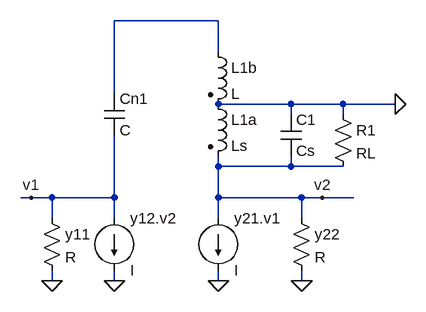
[diagram p0: schematic circuito_AC.asc]
circuito_AC.asc, the LTspice schematic file:
Version 4
SHEET 1 880 680
WIRE 16 -96 -144 -96
WIRE 16 -48 16 -96
WIRE -144 16 -144 -96
WIRE 128 32 16 32
WIRE 208 32 128 32
WIRE 288 32 208 32
WIRE 128 48 128 32
WIRE 208 48 208 32
WIRE 16 128 16 112
WIRE 128 128 128 112
WIRE 128 128 16 128
WIRE 208 128 128 128
WIRE -272 176 -288 176
WIRE -240 176 -272 176
WIRE -144 176 -144 80
WIRE -144 176 -240 176
WIRE 16 176 16 128
WIRE 144 176 16 176
WIRE 176 176 144 176
WIRE 224 176 176 176
WIRE -240 208 -240 176
WIRE -144 208 -144 176
WIRE 16 208 16 176
WIRE 144 208 144 176
WIRE -240 304 -240 288
WIRE -144 304 -144 288
WIRE 16 304 16 288
WIRE 144 304 144 288
FLAG 288 32 0
FLAG 16 304 0
FLAG -144 304 0
FLAG -240 304 0
FLAG 144 304 0
FLAG 176 176 v2
FLAG -272 176 v1
SYMBOL ind2 0 16 R0
SYMATTR InstName L1a
SYMATTR Value Ls
SYMATTR Type ind
SYMBOL ind2 0 -64 R0
SYMATTR InstName L1b
SYMATTR Type ind
SYMBOL cap -160 16 R0
SYMATTR InstName Cn1
SYMBOL cap 112 48 R0
SYMATTR InstName C1
SYMATTR Value Cs
SYMBOL res 192 32 R0
SYMATTR InstName R1
SYMATTR Value RL
SYMBOL current 16 208 R0
SYMATTR InstName y21.v1
SYMBOL current -144 208 R0
SYMATTR InstName y12.v2
SYMBOL res 128 192 R0
SYMATTR InstName y22
SYMBOL res -256 192 R0
SYMATTR InstName y11

The netlist it stands for:
* circuito_AC.asc
L1a 0 v2 Ls
L1b N001 0 L
Cn1 N001 v1 C
C1 0 v2 Cs
R1 0 v2 RL
I§y21.v1 v2 0 I
I§y12.v2 v1 0 I
R§y22 v2 0 R
R§y11 v1 0 R
.backanno
.end